# EAGLE design bffSquad (EAGLE 9.6.2)
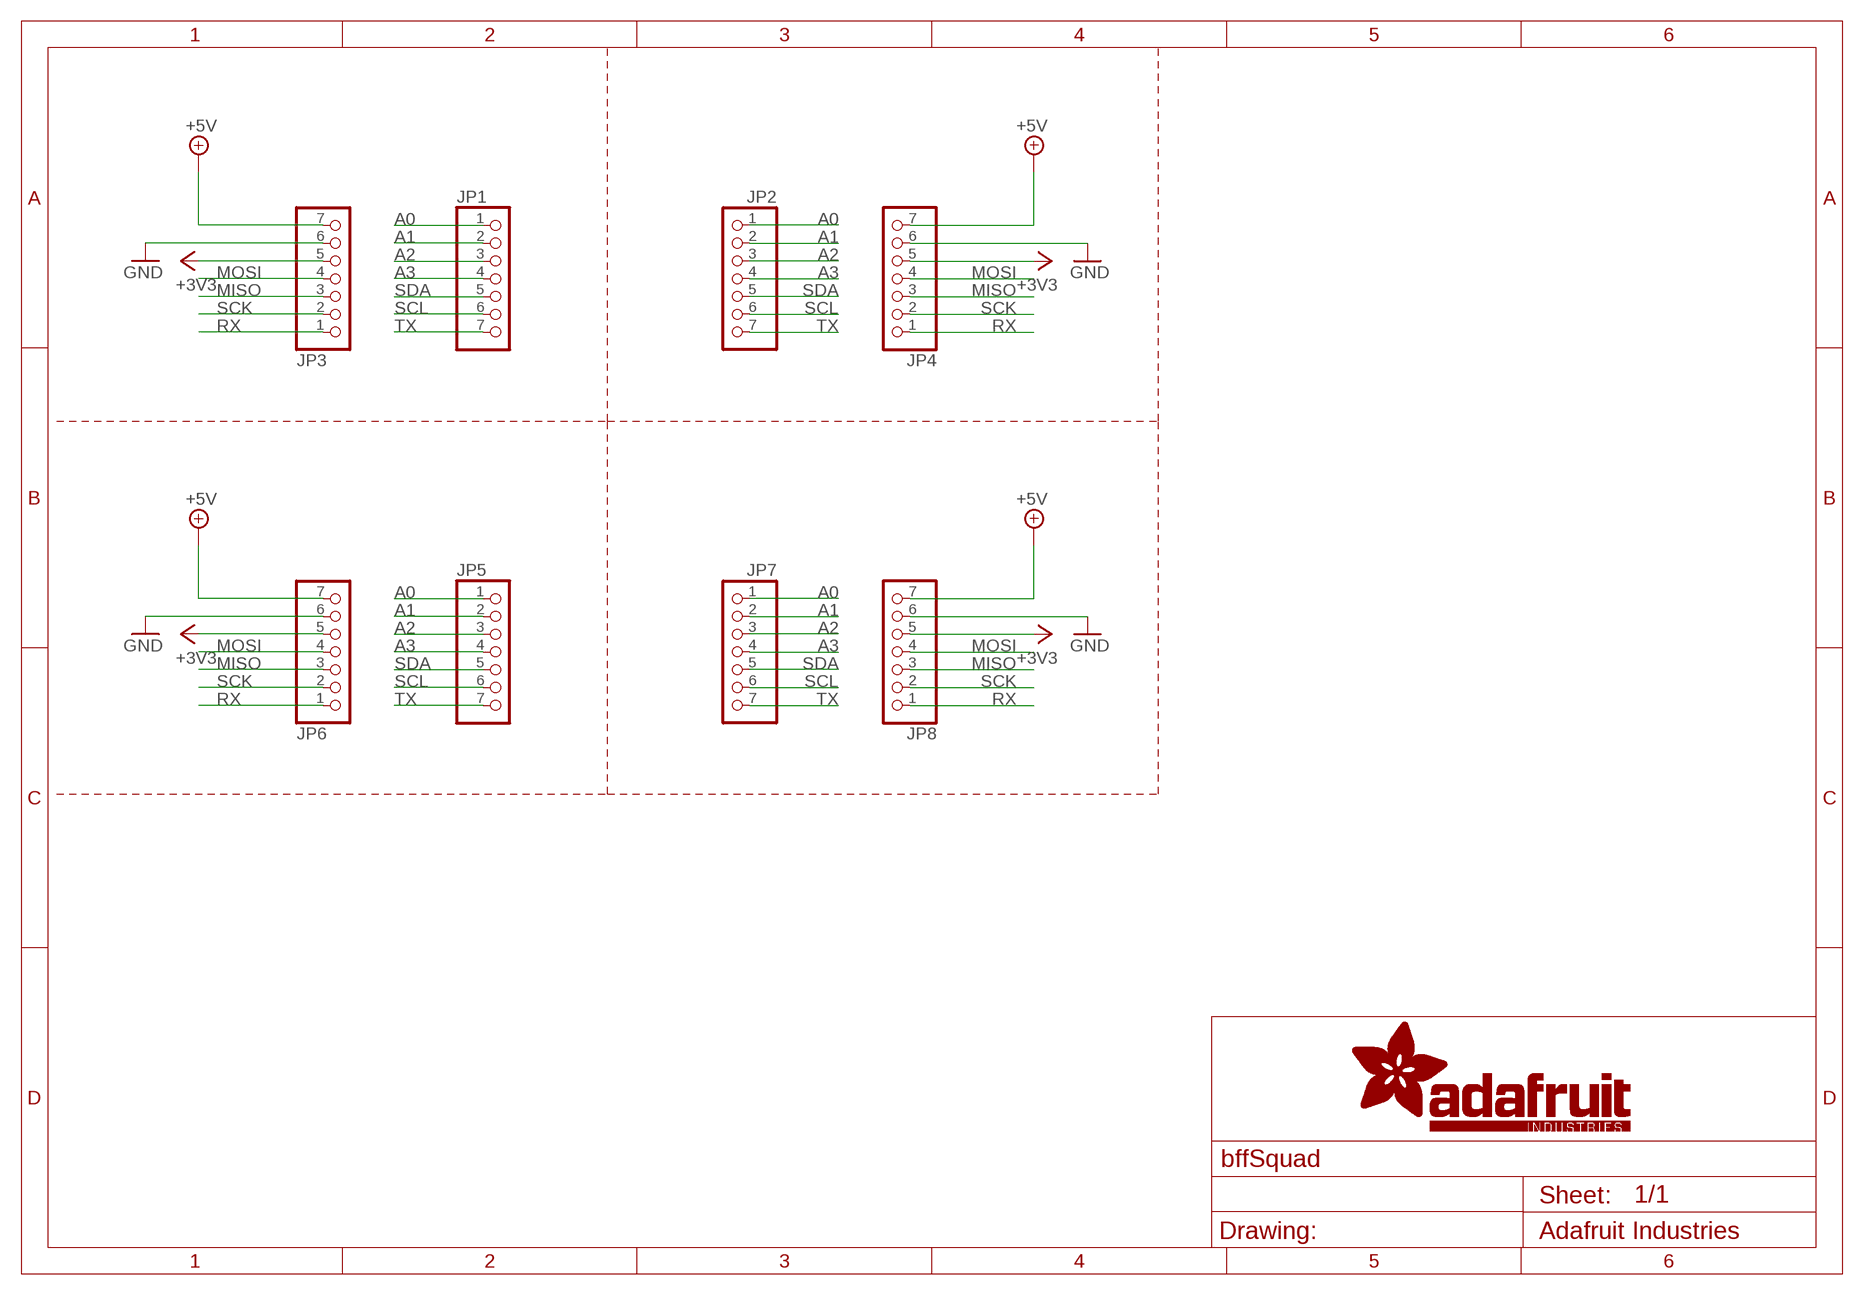
[diagram p0: schematic, sheet 1]

## Parts
JP1  HEADER-1X7ROUND  [1X07_ROUND]
JP2  HEADER-1X7ROUND  [1X07_ROUND]
JP3  HEADER-1X7ROUND  [1X07_ROUND]
JP4  HEADER-1X7ROUND  [1X07_ROUND]
JP5  HEADER-1X7ROUND  [1X07_ROUND]
JP6  HEADER-1X7ROUND  [1X07_ROUND]
JP7  HEADER-1X7ROUND  [1X07_ROUND]
JP8  HEADER-1X7ROUND  [1X07_ROUND]

## Nets
+3V3: JP3.5 JP4.5 JP6.5 JP8.5
+5V [power]: JP3.7 JP4.7 JP6.7 JP8.7
A0: JP1.1 JP2.1 JP5.1 JP7.1
A1: JP1.2 JP2.2 JP5.2 JP7.2
A2: JP1.3 JP2.3 JP5.3 JP7.3
A3: JP1.4 JP2.4 JP5.4 JP7.4
GND [power]: JP3.6 JP4.6 JP6.6 JP8.6
MISO: JP3.3 JP4.3 JP6.3 JP8.3
MOSI: JP3.4 JP4.4 JP6.4 JP8.4
RX: JP3.1 JP4.1 JP6.1 JP8.1
SCK: JP3.2 JP4.2 JP6.2 JP8.2
SCL: JP1.6 JP2.6 JP5.6 JP7.6
SDA: JP1.5 JP2.5 JP5.5 JP7.5
TX: JP1.7 JP2.7 JP5.7 JP7.7

## Library data of the parts
JP1-JP8 = microbuilder:HEADER-1X7: PIN HEADER

## Net classes
1 power: width 0.305 mm
2 gnd: width 0.254 mm

## Board
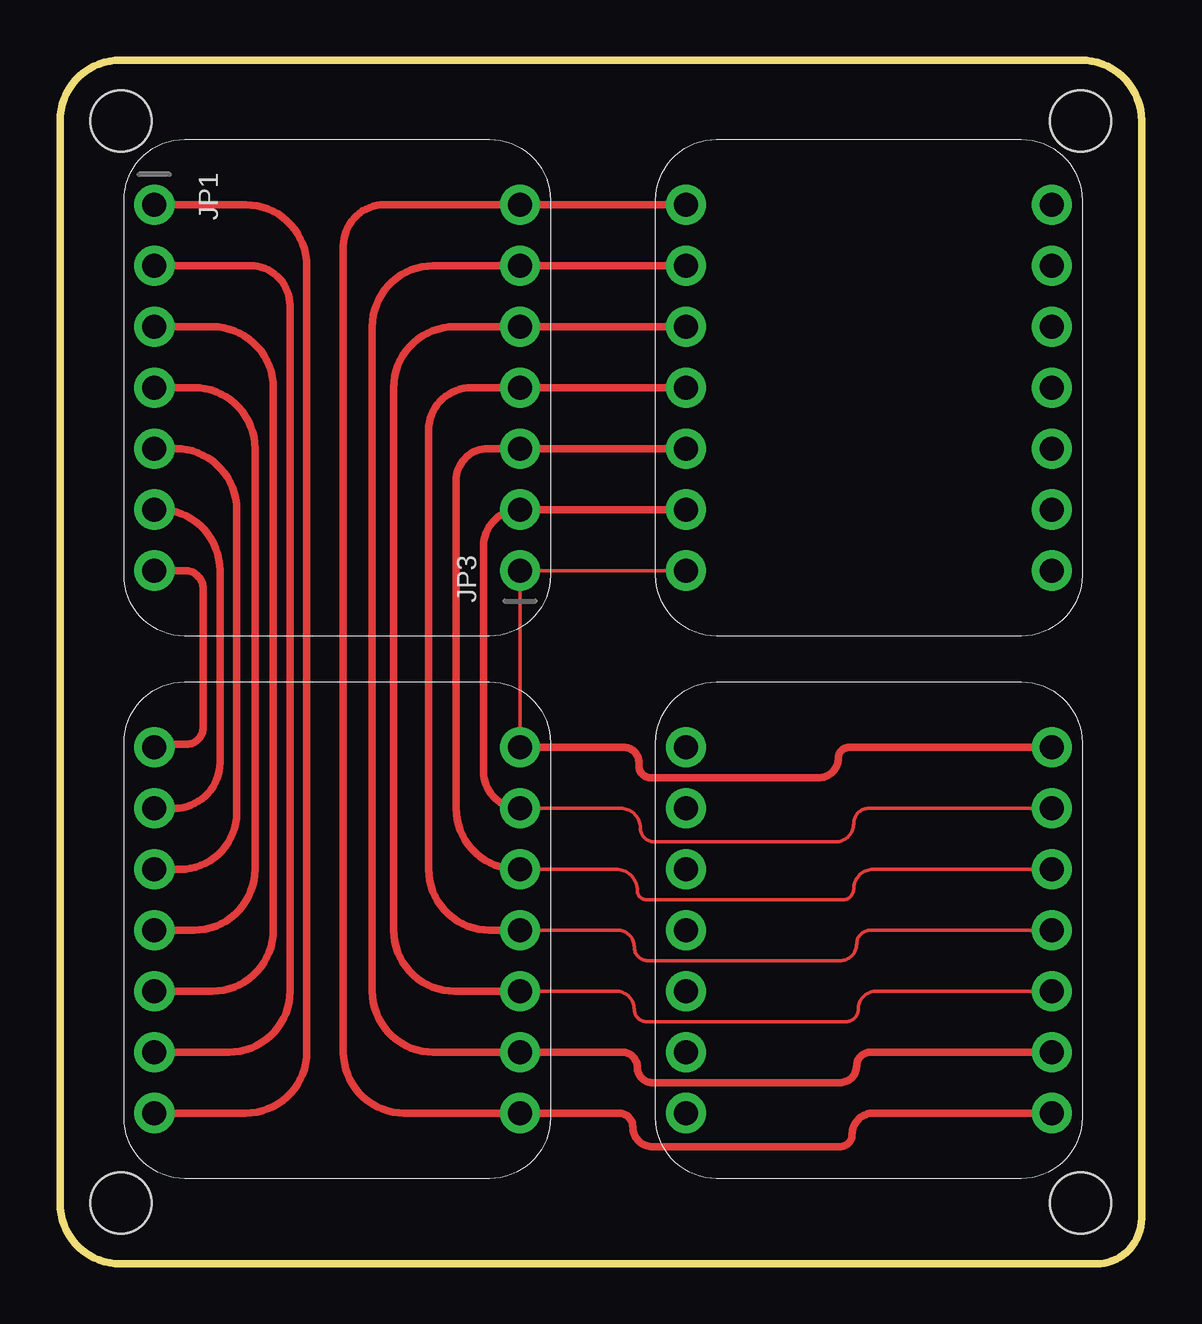
[diagram p1: board, top side]
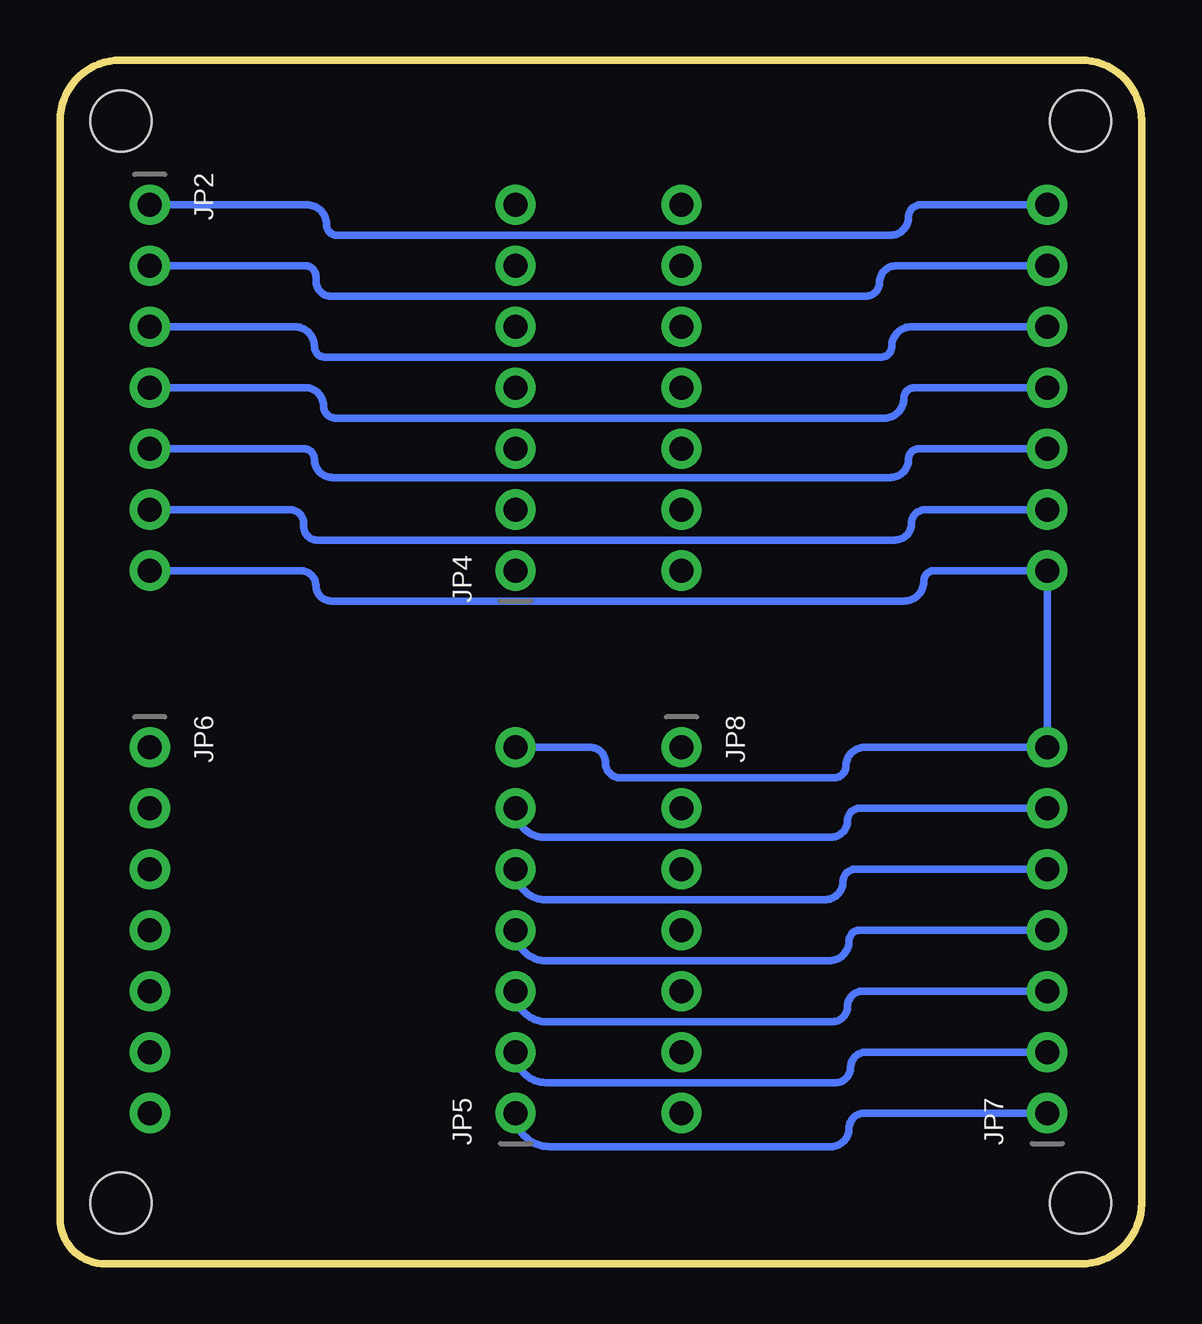
[diagram p2: board, bottom side, seen from below]

Size 45.09 x 50.16 mm. Coordinates in mm from the lower left corner, seen from the top.
Outline: 45.09,47.62 45.09,1.91 arc-90 43.18,0 2.54,0 arc-90 0,2.54 0,47.62 arc-90 2.54,50.16 42.54,50.16 arc-90 45.09,47.62
Copper layers (1*16): Top 0.035mm / dielectric 1.5mm / Bottom 0.035mm
Design rules "adafruit 6-6 *": minimum track width 6mil, minimum drill 15.5mil, track to track 6mil, track to pad 6mil, pad to pad 6mil, via to via 6mil, smd to smd 6mil, copper to edge 10mil, drill to drill 8mil, minimum pad ring 10mil, minimum via ring 8mil, stop-mask expansion 2mil, vias tented up to drill 20mil, thermal gap 10mil
Holes 2.54 mm at 2.54,2.54 42.54,2.54 42.54,47.62 2.54,47.62

### Footprints (pad centres in the part's own frame; a part is rotated, then mirrored left to right if it is on the bottom)
1X07_ROUND = drill 1 pad 1.676: 1 -7.62,0; 2 -5.08,0; 3 -2.54,0; 4 0,0; 5 2.54,0; 6 5.08,0; 7 7.62,0

### Placement (x,y rotation side)
JP1  3.94,36.51 270 top
JP2  41.34,36.51 270 bottom
JP3  19.18,36.51 90 top
JP4  26.1,36.51 90 bottom
JP5  26.1,13.91 90 bottom
JP6  41.34,13.91 270 bottom
JP7  3.94,13.91 90 bottom
JP8  19.18,13.91 270 bottom
PLABEL0  [PLABEL0]  13.65,36.2 90 top
PLABEL1  [PLABEL1]  36.51,36.2 90 top
PLABEL2  [PLABEL2]  9.84,13.33 270 top
PLABEL3  [PLABEL3]  32.38,13.02 270 top
PLABEL4  [PLABEL4]  7.62,44.77 0 top
PLABEL5  [PLABEL5]  27.31,26.99 0 top
PLABEL6  [PLABEL6]  40.32,26.99 0 top
PLABEL7  [PLABEL7]  40.32,23.5 180 top
PLABEL8  [PLABEL8]  18.1,23.5 180 top
PLABEL9  [PLABEL9]  27.31,23.5 180 top
PLABEL10  [PLABEL10]  5.08,23.5 180 top
PLABEL11  [PLABEL11]  18.1,26.99 0 top
PLABEL12  [PLABEL12]  5.08,26.99 0 top
PLABEL13  [PLABEL13]  30.48,44.77 0 top
PLABEL14  [PLABEL14]  38.1,5.71 180 top
PLABEL15  [PLABEL15]  15.56,5.71 180 top
PLABEL16  [PLABEL16]  33.97,27.94 0 bottom
PLABEL17  [PLABEL17]  33.97,18.73 0 bottom
PLABEL18  [PLABEL18]  17.15,17.15 0 bottom

### Tracks (layer width: path | path; a pad name or v marks a point on that pad's centre or on a via)
+3V3
  Top 0.152: JP8.5 23.18,11.37 arc-90 23.94,10.61 arc90 24.45,10.1 32.77,10.1 arc90 33.27,10.61 arc-90 34.04,11.37 JP6.5
  Top 0.305: JP4.5 JP3.5 16.45,39.05 arc90 13.91,36.51 13.91,13.91 arc90 16.45,11.37 JP8.5
+5V
  Top 0.305: JP6.7 33.91,6.29 arc90 33.02,5.4 arc-90 32.51,4.89 24.7,4.89 arc-90 23.88,5.71 arc90 23.3,6.29 JP8.7 14.35,6.29 arc-90 11.81,8.83 11.81,42.42 arc-90 13.53,44.13 JP3.7 JP4.7
A0
  Top 0.305: JP7.1 7.75,6.29 arc90 10.29,8.83 10.29,41.59 arc90 7.75,44.13 JP1.1
  Bottom 0.305: JP1.1 9.21,44.13 arc-90 9.72,43.62 arc90 10.48,42.86 33.53,42.86 arc90 33.97,43.31 arc-90 34.8,44.13 JP2.1 | JP5.1 arc-90 24.7,4.89 12.95,4.89 arc-90 12.19,5.65 arc90 11.56,6.29 JP7.1
A1
  Top 0.305: JP7.2 7.05,8.83 arc90 9.59,11.37 9.59,39.94 arc90 7.94,41.59 JP1.2
  Bottom 0.305: JP1.2 10.22,41.59 arc-90 10.92,40.89 arc90 11.49,40.32 33.78,40.32 arc90 34.42,40.96 34.42,41.15 arc-90 34.86,41.59 JP2.2 | JP5.2 arc-90 24.83,7.56 12.76,7.56 arc-90 12.13,8.19 arc90 11.49,8.83 JP7.2
A2
  Top 0.305: JP7.3 6.35,11.37 arc90 8.89,13.91 8.89,36.51 arc90 6.35,39.05 JP1.3
  Bottom 0.305: JP1.3 9.59,39.05 arc-90 10.41,38.23 arc90 10.86,37.78 34.04,37.78 arc90 34.48,38.23 arc-90 35.31,39.05 JP2.3 | JP5.3 arc-90 24.83,10.1 12.89,10.1 arc-90 12.25,10.73 arc90 11.62,11.37 JP7.3
A3
  Top 0.305: JP1.4 5.59,36.51 arc-90 8.13,33.97 8.13,16.45 arc-90 5.59,13.91 JP7.4
  Bottom 0.305: JP1.4 9.46,36.51 arc-90 9.91,36.07 arc90 10.73,35.24 33.59,35.24 arc90 34.1,35.75 arc-90 34.86,36.51 JP2.4 | JP5.4 arc-90 24.83,12.64 13.02,12.64 arc-90 12.19,13.46 arc90 11.75,13.91 JP7.4
GND
  Top 0.305: JP6.6 33.78,8.83 arc90 33.21,8.26 arc-90 32.51,7.56 24.7,7.56 arc-90 24.07,8.19 arc90 23.43,8.83 JP8.6 15.56,8.83 arc-90 13.02,11.37 13.02,39.05 arc-90 15.56,41.59 JP3.6 JP4.6
MISO
  Top 0.152: JP8.3 23.18,16.45 arc-90 24.07,15.56 arc90 24.45,15.18 32.64,15.18 arc90 33.08,15.62 arc-90 33.91,16.45 JP6.3
  Top 0.305: JP4.3 JP3.3 17.84,33.97 arc90 16.51,32.64 16.51,18.99 arc90 19.05,16.45 JP8.3
MOSI
  Top 0.152: JP8.4 23.24,13.91 arc-90 23.94,13.21 arc90 24.51,12.64 32.51,12.64 arc90 33.21,13.33 arc-90 33.78,13.91 JP6.4
  Top 0.305: JP4.4 JP3.4 17.15,36.51 arc90 15.37,34.73 15.37,16.45 arc90 17.91,13.91 JP8.4
RX
  Top 0.152: JP8.1 JP3.1 JP4.1
  Top 0.305: JP8.1 23.5,21.53 arc-90 24.13,20.89 24.13,20.77 arc90 24.64,20.26 31.62,20.26 arc90 32.45,21.08 arc-90 32.89,21.53 JP6.1
SCK
  Top 0.152: JP8.2 23.37,18.99 arc-90 24.19,18.16 arc90 24.77,17.59 32.32,17.59 arc90 33.08,18.35 arc-90 33.72,18.99 JP6.2
  Top 0.305: JP4.2 JP3.2 arc90 17.65,29.91 17.65,20.51 arc90 JP8.2
SCL
  Top 0.305: JP1.6 4.13,31.43 arc-90 6.67,28.89 6.67,20.89 arc-90 4.76,18.99 JP7.6
  Bottom 0.305: JP1.6 9.02,31.43 arc-90 9.59,30.86 arc90 10.29,30.16 34.35,30.16 arc90 34.92,30.73 34.92,30.86 arc-90 35.5,31.43 JP2.6 | JP5.6 arc-90 24.89,17.78 12.95,17.78 arc-90 12.25,18.48 arc90 11.75,18.99 JP7.6
SDA
  Top 0.305: JP1.5 4.83,33.97 arc-90 7.37,31.43 7.37,18.8 arc-90 5.02,16.45 JP7.5
  Bottom 0.305: JP1.5 9.27,33.97 arc-90 9.72,33.53 arc90 10.48,32.77 33.72,32.77 arc90 34.48,33.53 arc-90 34.92,33.97 JP2.5 | JP5.5 arc-90 24.83,15.18 13.21,15.18 arc-90 12.45,15.94 arc90 11.94,16.45 JP7.5
TX
  Top 0.305: JP1.7 5.21,28.89 arc-90 5.97,28.13 5.97,22.35 arc-90 5.27,21.65 4.06,21.65 arc90 JP7.7
  Bottom 0.305: JP2.7 35.05,28.89 arc90 34.42,28.26 arc-90 33.78,27.62 9.91,27.62 arc-90 9.08,28.45 arc90 8.64,28.89 JP1.7 JP7.7 11.56,21.53 arc-90 12.32,20.77 arc90 12.83,20.26 21.72,20.26 arc90 22.35,20.89 arc-90 22.99,21.53 JP5.7

### Text on the board
Pinguin_tBackup: ^USB^ | ^USB^ | QT Py / Here | BFF / Here | A0 / A1 / A2 / A3 / D / C / TX | 5V / G / 3V / MO / MI / SCK / RX | 5V / G / 3V / MO / MI / SCK / RX | A0 / A1 / A2 / A3 / D / C / TX | A0 / A1 / A2 / A3 / D / C / TX | 5V / G / 3V / MO / MI / SCK / RX | A0 / A1 / A2 / A3 / D / C / TX | 5V / G / 3V / MO / MI / SCK / RX | BFF / Here | BFF / Here | ^USB^ | ^USB^
Pinguin_bBackup: BFF / Squad | v0 / July 2023 | 👯 / / 👯